# EAGLE design Tester (EAGLE 6.4)
COPYRIGHT: based on Transistortester (microcontroller.net); PROJECT_INFO: extented version with backlight dimmer; PROJECT_NAME: Component Tester
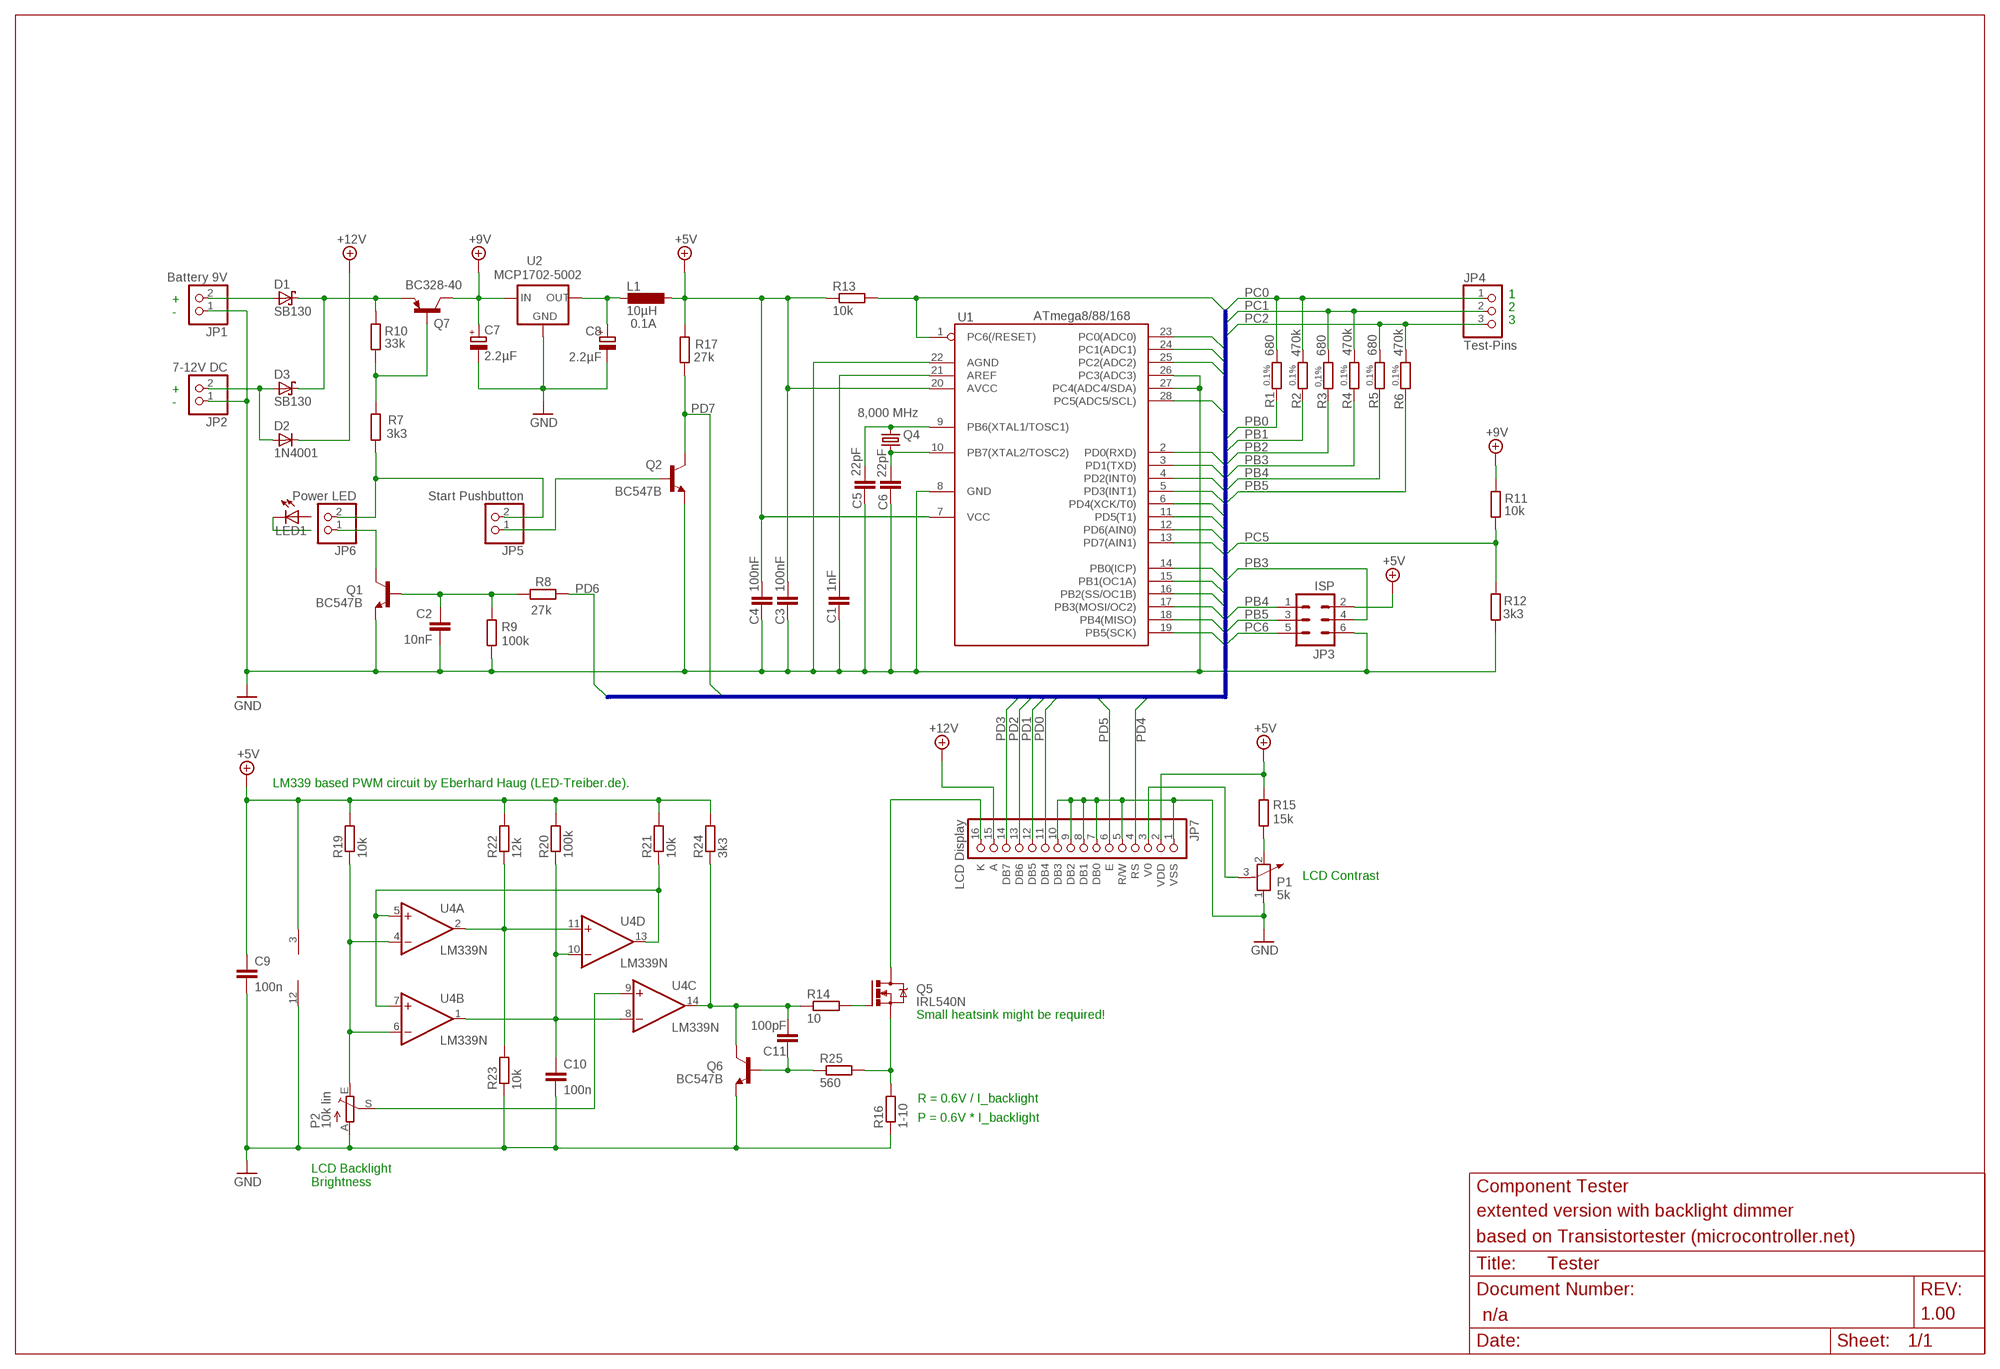
[diagram p0: schematic, sheet 1]
FRAME1 (FRAME_A3): DOCUMENT_ID: n/a; REVISION_ID: 1.00

## Parts
C1  1nF  C2.5/2  [C2.5-2]
C2  10nF  C2,5-3  [C2.5-3]
C3  100nF  C5/3  [C5B3]
C4  100nF  C5/3  [C5B3]
C5  22pF  C2,5-3  [C2.5-3]
C6  22pF  C2,5-3  [C2.5-3]
C7  2.2µF  CPOL-EUE5-5  [E5-5]
C8  2.2µF  CPOL-EUE5-5  [E5-5]
C9  100n  C-EU050-024X044  [C050-024X044]
C10  100n  C-EU050-024X044  [C050-024X044]
C11  100pF  C2.5/2  [C2.5-2]
D1  SB130  SCHOTTKY-DIODE_RAD3-5-A  [DIODE-3-5A-V]
D2  1N4001  DIODE_RAD3-5-A  [DIODE-3-5A-V]
D3  SB130  SCHOTTKY-DIODE_RAD3-5-A  [DIODE-3-5A-V]
JP1  Battery 9V  PINHD-1X2-PCB  [PINHD-1X02]
JP2  7-12V DC  PINHD-1X2-PCB  [PINHD-1X02]
JP3  ISP  ML6  [ML6]
JP4  Test-Pins  PINHD-1X3-PCB  [PINHD-1X03]
JP5  Start Pushbutton  PINHD-1X2-PCB  [PINHD-1X02]
JP6  Power LED  PINHD-1X2-PCB  [PINHD-1X02]
JP7  LCD Display  PINHD-1X16-LCD-TOP  [PINHD-1X16]
L1  10µH  L-EU0204/7  [0204/7]
LED1  LED_EXT  (no package)
P1  5k  POTENTIOMETER_PT-10  [PT-10]
P2  10k lin  TRIM_EU-LI10  [LI10]
Q1  BC547B  [TO92]
Q2  BC547B  [TO92]
Q4  8,000 MHz  CRYSTALHC49S  [HC49/S]
Q5  IRL540N  IRL540N-V  [TO220BV]
Q6  BC547B  [TO92]
Q7  BC328-40  [TO92-EBC]
R1  680  R-EU_0207/10  [0207/10]
R2  470k  R-EU_0207/10  [0207/10]
R3  680  R-EU_0207/10  [0207/10]
R4  470k  R-EU_0207/10  [0207/10]
R5  680  R-EU_0207/10  [0207/10]
R6  470k  R-EU_0207/10  [0207/10]
R7  3k3  R-EU_0207/10  [0207/10]
R8  27k  R-EU_0207/2V  [0207/2V]
R9  100k  R-EU_0207/2V  [0207/2V]
R10  33k  R-EU_0207/2V  [0207/2V]
R11  10k  R-EU_0207/2V  [0207/2V]
R12  3k3  R-EU_0207/2V  [0207/2V]
R13  10k  R-EU_0207/10  [0207/10]
R14  10  R-EU_0207/2V  [0207/2V]
R15  15k  R-EU_0207/10  [0207/10]
R16  1-10  R-EU_0207/10  [0207/10]
R17  27k  R-EU_0207/2V  [0207/2V]
R19  10k  R-EU_0207/2V  [0207/2V]
R20  100k  R-EU_0207/5V  [0207/5V]
R21  10k  R-EU_0207/2V  [0207/2V]
R22  12k  R-EU_0207/5V  [0207/5V]
R23  10k  R-EU_0207/5V  [0207/5V]
R24  3k3  R-EU_0207/5V  [0207/5V]
R25  560  R-EU_0207/5V  [0207/5V]
U1  ATmega8/88/168  MEGA8-P  [DIL28-3]
U2  MCP1702-5002  [TO92-LOWDROP]
U4  LM339N  [DIL14]

## Nets
+5V: C3.2 C4.1 C9.1 JP3.2 JP7.2(VDD) L1.1 R13.1 R15.1 R17.2 R19.2 R20.2 R21.2 R22.2 R24.2 U1.7(VCC) U1.20(AVCC) U4.3(P:V+)
+9V: C7.+ Q7.C R11.1 U2.IN
+12V: D2.C JP7.15(A)
BL_K: JP7.16(K) Q5.D
GND: C1.1 C2.2 C3.1 C4.2 C5.1 C6.1 C7.- C8.- C9.2 C10.2 JP1.1 JP2.1 JP3.6 JP7.1(VSS) JP7.5(R/W) JP7.7(DB0) JP7.8(DB1) JP7.9(DB2) JP7.10(DB3) P1.1 P2.A Q1.1(E) Q2.1(E) Q6.1(E) R9.1 R12.1 R16.1 R23.1 U1.8(GND) U1.22(AGND) U1.26(PC3(ADC3)) U1.27(PC4(ADC4/SDA)) U2.GND U4.12(P:GND)
N$1: P1.2 R15.2
N$2: JP7.3(V0) P1.3
N$3: Q5.S R16.2 R25.2
N$4: R22.1 R23.2 U4.2(A:OUT) U4.11(D:+IN)
N$5: D1.C D3.C Q7.E R10.1
N$6: C10.1 R20.1 U4.1(B:OUT) U4.8(C:-IN) U4.10(D:-IN)
N$7: R21.1 U4.5(A:+IN) U4.7(B:+IN) U4.13(D:OUT)
N$8: JP6.1 Q1.3(C)
N$9: D1.A JP1.2
N$10: C1.2 U1.21(AREF)
N$11: LED1.C
N$12: C5.2 Q4.2 U1.9(PB6(XTAL1/TOSC1))
N$13: C6.2 Q4.1 U1.10(PB7(XTAL2/TOSC2))
N$14: JP5.1 Q2.2(B)
N$15: P2.E R19.1 U4.4(A:-IN) U4.6(B:-IN)
N$16: P2.S U4.9(C:+IN)
N$17: C11.2 Q6.3(C) R14.1 R24.1 U4.14(C:OUT)
N$18: Q5.G R14.2
N$19: C11.1 Q6.2(B) R25.1
N$20: C8.+ L1.2 U2.OUT
N$21: JP5.2 JP6.2 R7.1
N$22: D2.A D3.A JP2.2
N$33: Q7.B R7.2 R10.2
N$35: C2.1 Q1.2(B) R8.2 R9.2
PB0: R1.1 U1.14(PB0(ICP))
PB1: R2.1 U1.15(PB1(OC1A))
PB2: R3.1 U1.16(PB2(SS/OC1B))
PB3: JP3.4 R4.1 U1.17(PB3(MOSI/OC2))
PB4: JP3.1 R5.1 U1.18(PB4(MISO))
PB5: JP3.3 R6.1 U1.19(PB5(SCK))
PC0: JP4.1 R1.2 R2.2 U1.23(PC0(ADC0))
PC1: JP4.2 R3.2 R4.2 U1.24(PC1(ADC1))
PC2: JP4.3 R5.2 R6.2 U1.25(PC2(ADC2))
PC5: R11.2 R12.2 U1.28(PC5(ADC5/SCL))
PC6: JP3.5 R13.2 U1.1(PC6(/RESET))
PD0: JP7.11(DB4) U1.2(PD0(RXD))
PD1: JP7.12(DB5) U1.3(PD1(TXD))
PD2: JP7.13(DB6) U1.4(PD2(INT0))
PD3: JP7.14(DB7) U1.5(PD3(INT1))
PD4: JP7.4(RS) U1.6(PD4(XCK/T0))
PD5: JP7.6(E) U1.11(PD5(T1))
PD6: R8.1 U1.12(PD6(AIN0))
PD7: Q2.3(C) R17.1 U1.13(PD7(AIN1))
Unconnected: LED1.A

## Buses
BUS1:PB[0..5],PC[0..6],PD[0..7]

## Notes on the sheet
- 1
- +
- 2
- -
- 3
- +
- -
- LM339 based PWM circuit by Eberhard Haug (LED-Treiber.de).
- LCD Contrast
- Small heatsink might be required!
- R = 0.6V / I_backlight
- P = 0.6V * I_backlight
- LCD Backlight
  Brightness

## Library data of the parts
C1-C6 C11 = capacitor-wima:C: CAPACITOR naming: grid - package width
C7 C8 = rcl:CPOL-EU: POLARIZED CAPACITOR, European symbol
C9 C10 = resistor:C-EU: CAPACITOR, European symbol
D1 D3 = markus:SCHOTTKY-DIODE: Schottky Diode
D2 = markus:DIODE: Diode
JP1 JP2 JP5 JP6 = markus:PINHD-1X2-PCB: PIN HEADER
JP3 = con-ml:ML6: HARTING; OC_FARNELL: unknown; OC_NEWARK: unknown
JP4 = markus:PINHD-1X3-PCB: PIN HEADER
JP7 = markus:PINHD-1X16-LCD: Pin Header for LCD module 16 pin supports bottom and top types
L1 = rcl:L-EU: INDUCTOR, European symbol; CURRENT: 0.1A
LED1 = markus:LED_EXT: Standard LED; _EXTERNAL_: external device
P1 = rcl:POTENTIOMETER_: Potentiometer
P2 = pot:TRIM_EU-: POTENTIOMETER
Q1 Q2 Q6 = transistor-npn:BC547*: NPN Transistor
Q4 = crystal:CRYSTAL: CRYSTAL; OC_FARNELL: 1667008; OC_NEWARK: unknown
Q5 = markus:IRL540N: HEXFET Power MOSFET Logic-Level Gate VDSS = 100V RDS(on) = 0.044Ω ID = 36A
Q7 = transistor-pnp:BC328*: PNP Transistror
R1 R2 R4-R6 = resistor:R-EU_: RESISTOR, European symbol; TOLERANCE: 0.1%
R3 = resistor:R-EU_: RESISTOR, European symbol; TOLERANCE: 0,1%
R7-R17 R19-R25 = resistor:R-EU_: RESISTOR, European symbol
U1 = avr-6:MEGA8-P: MICROCONTROLLER 8 Kbytes FLASH 1 kbytes SRAM 512 bytes EEPROM USART 4-channel 10 bit ADC 2-channel 8 bit ADC
U2 = asko:MCP1702-5002
U4 = linear:LM339: Low Power Low Offset Voltage Quad Comparators with open collector; LM139/LM239/LM339/LM2901/LM3302

## Net classes
0 default: width 0.406 mm, drill 0.8 mm

## Board
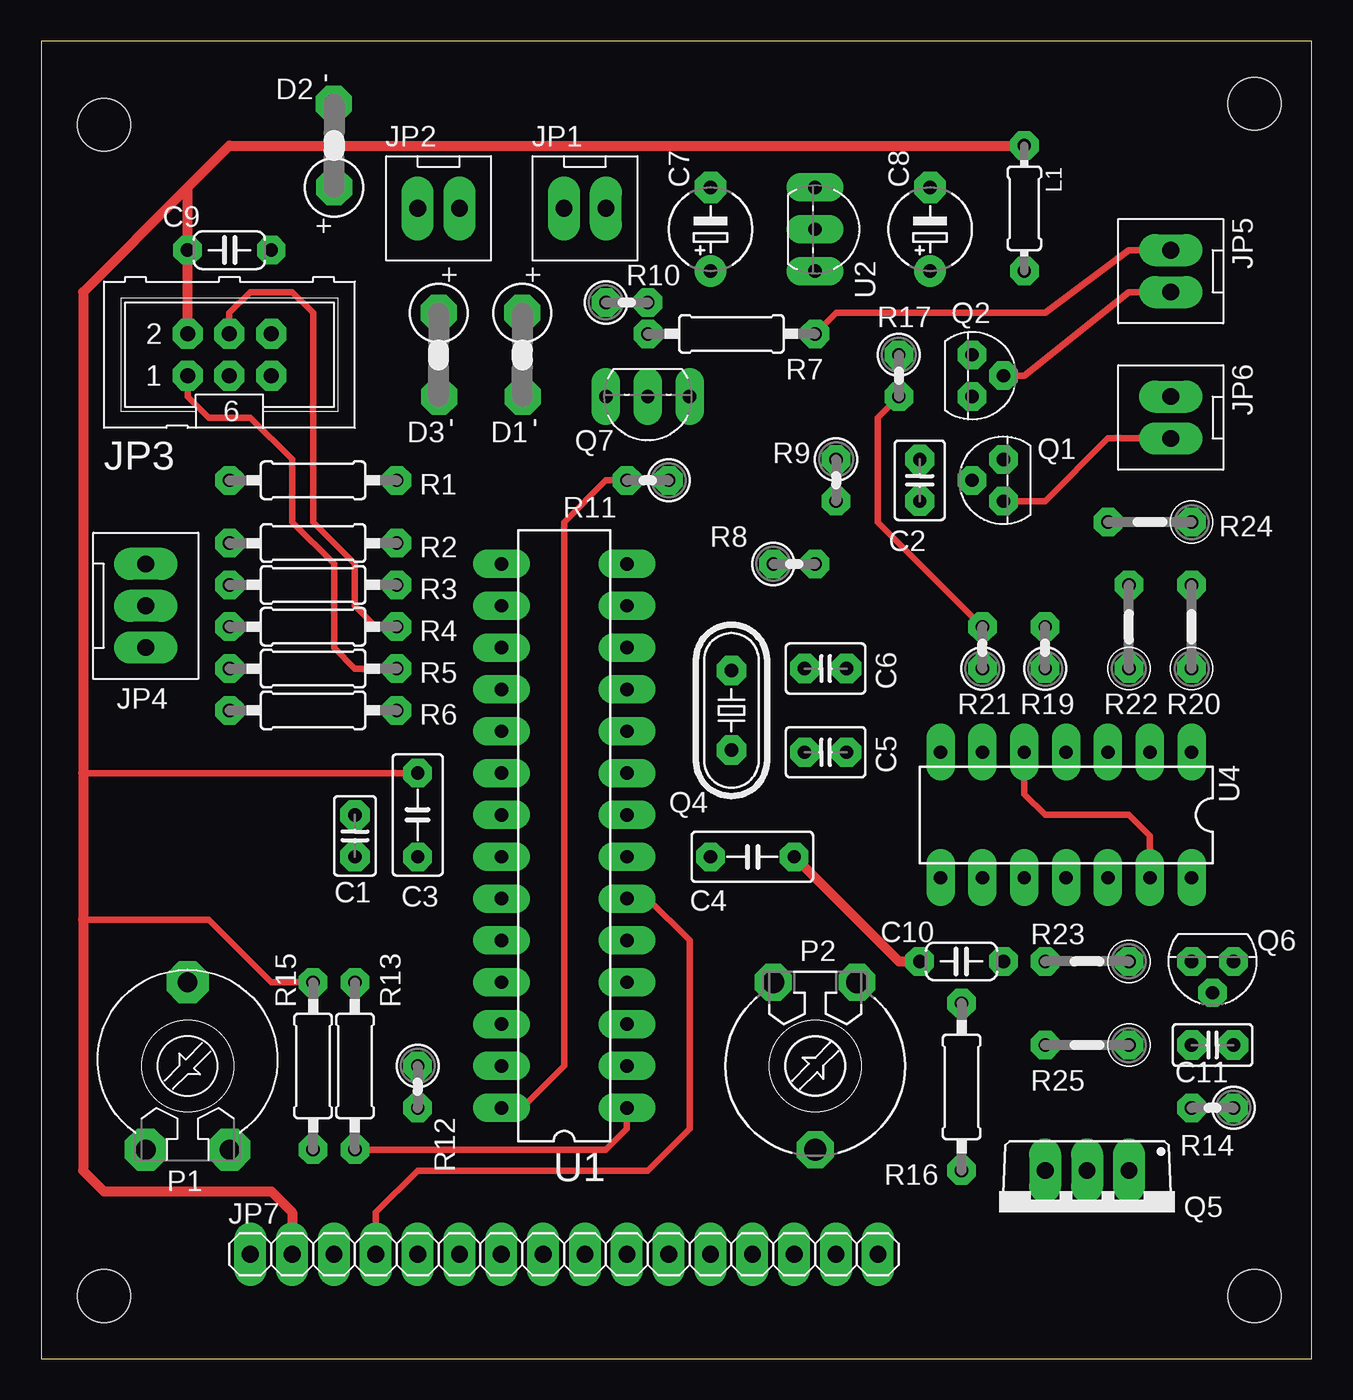
[diagram p1: board, top side]
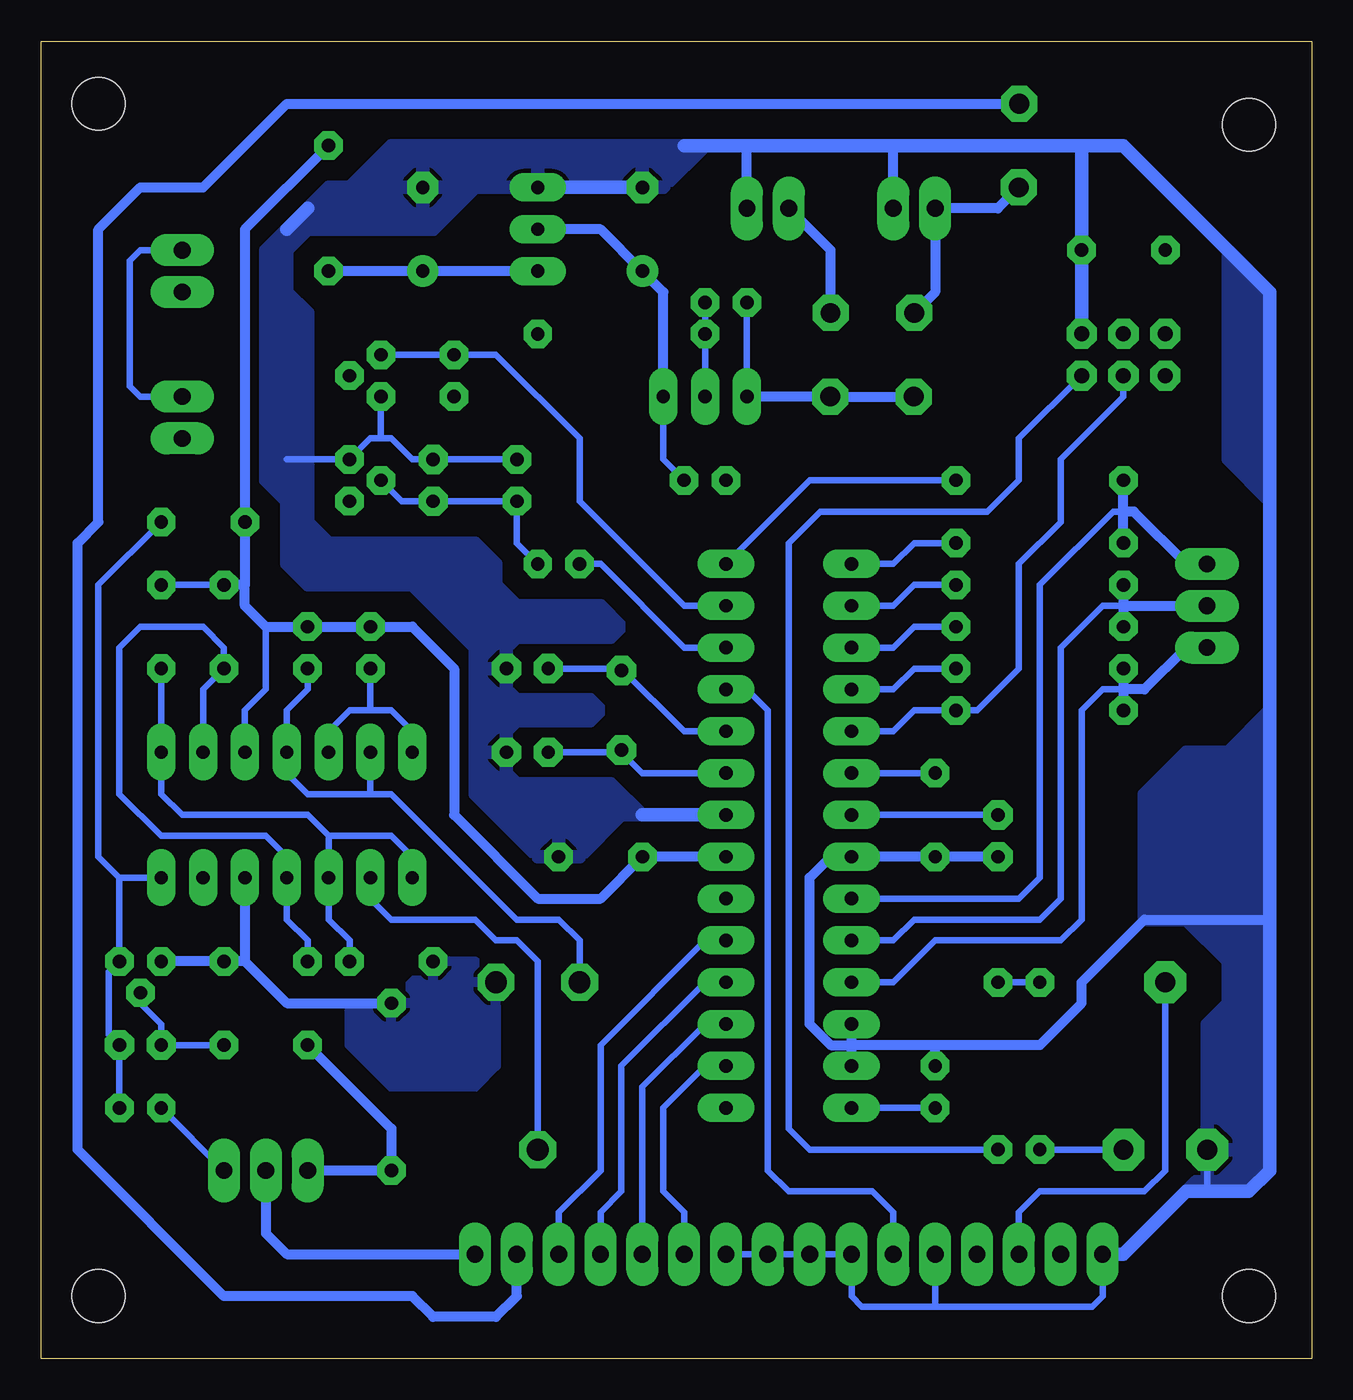
[diagram p2: board, bottom side, seen from below]

Size 77.14 x 80 mm. Coordinates in mm from the lower left corner, seen from the top.
Outline: 0,0 77.14,0 77.14,80 0,80 0,0
Copper layers (1*16): Top 0.035mm / dielectric 1.5mm / Bottom 0.035mm
Design rules "default": minimum track width 10mil, minimum drill 24mil, track to track 8mil, track to pad 8mil, pad to pad 8mil, via to via 8mil, smd to smd 8mil, copper to edge 40mil, drill to drill 8mil, minimum pad ring 18mil, minimum via ring 8mil, stop-mask expansion 4mil, vias tented up to drill 0mil, thermal gap 10mil
Holes 3.2 mm at 3.81,3.81 73.66,3.81 3.81,74.93 73.66,76.2

### Footprints (pad centres in the part's own frame; a part is rotated, then mirrored left to right if it is on the bottom)
C2.5-2 = drill 0.813 pad 1.778 octagon: 1 -1.27,0; 2 1.27,0
C2.5-3 = drill 0.813 pad 1.778 octagon: 1 -1.27,0; 2 1.27,0
C5B3 = drill 0.813 pad 1.6 octagon: 1 -2.54,0; 2 2.54,0
E5-5 = drill 0.813 pad 1.905: + -2.54,0 | drill 0.813 pad 1.905 octagon: - 2.54,0
C050-024X044 = drill 0.813 octagon: 1 -2.54,0; 2 2.54,0
DIODE-3-5A-V = drill 1.2 pad 2.184 octagon: A -2.54,0; C 2.54,0.025
PINHD-1X02 = drill 1.016 long: 1 1.27,0; 2 -1.27,0
ML6 = drill 0.914 octagon: 1 -2.54,-1.27; 2 -2.54,1.27; 3 0,-1.27; 4 0,1.27; 5 2.54,-1.27; 6 2.54,1.27
PINHD-1X03 = drill 1.016 long: 1 2.54,0; 2 0,0; 3 -2.54,0
PINHD-1X16 = drill 1.016 long: 1 -19.05,0; 2 -16.51,0; 3 -13.97,0; 4 -11.43,0; 5 -8.89,0; 6 -6.35,0; 7 -3.81,0; 8 -1.27,0; 9 1.27,0; 10 3.81,0; 11 6.35,0; 12 8.89,0; 13 11.43,0; 14 13.97,0; 15 16.51,0; 16 19.05,0
0204/7 = drill 0.813 octagon: 1 -3.81,0; 2 3.81,0
PT-10 = drill 1.2 pad 2.54 octagon: 1 -2.54,-5.08; 2 2.54,-5.08; 3 0,5.08
LI10 = drill 1.321 octagon: A -2.54,-5.08; E 2.54,-5.08; S 0,5.08
TO92 = drill 0.813 octagon: 1 1.27,0; 2 0,1.905; 3 -1.27,0
HC49/S = drill 0.813 pad 1.778 octagon: 1 -2.413,0; 2 2.413,0
TO220BV = drill 1.016 long: D 0,-2.54; G -2.54,-2.54; S 2.54,-2.54
TO92-EBC = drill 0.813 long: B 0,-1.27; C -2.54,-1.27; E 2.54,-1.27
0207/10 = drill 0.813 octagon: 1 -5.08,0; 2 5.08,0
0207/2V = drill 0.813 octagon: 1 -1.27,0; 2 1.27,0
0207/5V = drill 0.813 octagon: 1 -2.54,0; 2 2.54,0
DIL28-3 = drill 0.813 long: 1 -16.51,-3.81; 2 -13.97,-3.81; 3 -11.43,-3.81; 4 -8.89,-3.81; 5 -6.35,-3.81; 6 -3.81,-3.81; 7 -1.27,-3.81; 8 1.27,-3.81; 9 3.81,-3.81; 10 6.35,-3.81; 11 8.89,-3.81; 12 11.43,-3.81; 13 13.97,-3.81; 14 16.51,-3.81; 15 16.51,3.81; 16 13.97,3.81; 17 11.43,3.81; 18 8.89,3.81; 19 6.35,3.81; 20 3.81,3.81; 21 1.27,3.81; 22 -1.27,3.81; 23 -3.81,3.81; 24 -6.35,3.81; 25 -8.89,3.81; 26 -11.43,3.81; 27 -13.97,3.81; 28 -16.51,3.81
TO92-LOWDROP = drill 0.813 long: GND -3.81,0; IN -1.27,0; OUT 1.27,0
DIL14 = drill 0.813 long: 1 -7.62,-3.81; 2 -5.08,-3.81; 3 -2.54,-3.81; 4 0,-3.81; 5 2.54,-3.81; 6 5.08,-3.81; 7 7.62,-3.81; 8 7.62,3.81; 9 5.08,3.81; 10 2.54,3.81; 11 0,3.81; 12 -2.54,3.81; 13 -5.08,3.81; 14 -7.62,3.81

### Placement (x,y rotation side)
C1  19.05,31.75 90 top
C2  53.34,53.34 90 top
C3  22.86,33.02 90 top
C4  43.18,30.48 0 top
C5  47.62,36.83 180 top
C6  47.62,41.91 180 top
C7  40.64,68.58 90 top
C8  53.98,68.58 90 top
C9  11.43,67.31 0 top
C10  55.88,24.13 180 top
C11  71.12,19.05 0 top
D1  29.21,60.96 270 top
D2  17.78,73.66 90 top
D3  24.13,60.96 270 top
JP1  33.02,69.85 0 top
JP2  24.13,69.85 0 top
JP3  11.43,60.96 0 top
JP4  6.35,45.72 90 top
JP5  68.58,66.04 270 top
JP6  68.58,57.15 270 top
JP7  31.75,6.35 0 top
L1  59.69,69.85 270 top
P1  8.89,17.78 0 top
P2  46.99,17.78 180 top
Q1  58.42,53.34 90 top
Q2  56.52,59.69 270 top
Q4  41.91,39.37 270 top
Q5  63.5,8.89 180 top
Q6  71.12,24.13 180 top
Q7  36.83,57.15 180 top
R1  16.51,53.34 180 top
R2  16.51,49.53 180 top
R3  16.51,46.99 180 top
R4  16.51,44.45 180 top
R5  16.51,41.91 180 top
R6  16.51,39.37 180 top
R7  41.91,62.23 180 top
R8  45.72,48.26 0 top
R9  48.26,53.34 270 top
R10  35.56,64.14 0 top
R11  36.83,53.34 180 top
R12  22.86,16.51 270 top
R13  19.05,17.78 270 top
R14  71.12,15.24 180 top
R15  16.51,17.78 270 top
R16  55.88,16.51 270 top
R17  52.07,59.69 270 top
R19  60.96,43.18 90 top
R20  69.85,44.45 90 top
R21  57.15,43.18 90 top
R22  66.04,44.45 90 top
R23  63.5,24.13 180 top
R24  67.31,50.8 180 top
R25  63.5,19.05 180 top
U1  31.75,31.75 90 top
U2  46.99,67.31 270 top
U4  62.23,33.02 180 top

### Tracks (layer width: path | path; a pad name or v marks a point on that pad's centre or on a via)
+5V
  Top 0.406: C3.2 2.54,35.56 | R15.1 13.97,22.86 10.16,26.67 2.54,26.67 | R17.2 50.8,57.15 50.8,50.8 R21.2
  Top 0.61: JP7.2 15.24,8.89 13.97,10.16 3.81,10.16 2.54,11.43 2.54,26.67 2.54,35.56 2.54,64.77 8.89,71.12 | 8.89,71.12 11.43,73.66 L1.1 | 8.89,71.12 C9.1 JP3.2
  Bottom 0.406: U1.20 C3.2 | R15.1 R13.1 | R20.2 R22.2 | U4.3 64.77,39.37 63.5,40.64 63.5,44.45
  Bottom 0.61: U1.7 C4.1 43.18,27.94 46.99,27.94 52.07,33.02 52.07,41.91 54.61,44.45 R21.2 R19.2 63.5,44.45 64.77,45.72 64.77,46.99 | L1.1 64.77,68.58 R24.2 64.77,46.99 | 64.77,46.99 R22.2
+9V
  Bottom 0.406: Q7.C 39.37,54.61 R11.1
  Bottom 0.61: U2.IN 43.18,68.58 C7.+ 39.37,64.77 Q7.C
+12V
  Bottom 0.61: JP7.15 48.26,3.81 49.53,2.54 53.34,2.54 54.61,3.81 66.04,3.81 74.93,12.7 74.93,49.53 73.66,50.8 73.66,68.58 71.12,71.12 67.31,71.12 62.23,76.2 D2.C
BL_K
  Bottom 0.61: Q5.D 63.5,7.62 62.23,6.35 JP7.16
GND
  Top 0.61: C4.2 52.07,24.13 C10.2
  Bottom 0.406: JP7.10 JP7.9 JP7.8 JP7.7 27.94,3.81 27.3,3.17 22.86,3.17 | 22.86,3.17 13.34,3.17 12.7,3.81 JP7.1 | JP7.5 22.86,3.17 | P1.1 6.35,10.16 | 62.23,54.61 Q1.1 57.15,55.88 56.52,55.88 | 56.52,55.88 55.88,55.88 54.61,54.61 C2.2 R9.1 | Q2.1 56.52,55.88
  Bottom 0.61: C1.1 C3.1 U1.22 29.21,30.48 30.48,29.21 30.48,20.32 29.21,19.05 27.94,19.05 | U1.27 27.94,19.05 | 27.94,19.05 U1.26 | 2.54,26.67 10.16,26.67 13.97,22.86 13.97,21.59 16.51,19.05 22.86,19.05 | 22.86,19.05 27.94,19.05 | R12.1 22.86,19.05 | U4.12 64.77,24.13 | 64.77,24.13 62.23,21.59 R16.1 | 64.77,24.13 R23.1 Q6.1 | JP1.1 34.29,73.66 | JP2.1 25.4,73.66
  Bottom 0.813: C7.- U2.GND | 13.97,73.66 11.43,73.66 2.54,64.77 2.54,26.67 2.54,11.43 3.81,10.16 6.35,10.16 7.62,10.16 11.43,6.35 JP7.1 | 13.97,73.66 25.4,73.66 34.29,73.66 38.1,73.66 | 60.96,69.85 62.23,68.58 | U1.8 40.64,33.02 | JP3.6 C9.2 13.97,73.66
  pour Bottom: 2.54,39.37 5.08,36.83 7.62,36.83 10.16,34.29 10.16,26.67 7.62,26.67 5.08,24.13 5.08,21.59 6.35,20.32 6.35,11.43 7.62,10.16 3.81,10.16 2.54,11.43
  pour Bottom: 2.54,52.07 5.08,54.61 5.08,67.31 2.54,64.77
  pour Bottom: 36.83,73.66 39.37,71.12 50.8,71.12 53.34,68.58 60.96,68.58 62.23,67.31 62.23,64.77 60.96,63.5 60.96,50.8 59.69,49.53 50.8,49.53 49.53,48.26 49.53,46.99 48.26,45.72 43.18,45.72 41.91,44.45 42.55,43.81 48.26,43.81 48.9,43.18 48.9,40.64 48.26,40.01 43.81,40.01 43.18,39.37 43.81,38.73 48.26,38.73 48.9,38.1 48.9,35.56 48.26,34.92 42.55,34.92 40.64,33.02 41.91,33.02 44.45,30.48 46.99,30.48 50.8,34.29 50.8,43.18 54.61,46.99 60.96,46.99 62.23,48.26 62.23,52.07 63.5,53.34 63.5,67.31 59.69,71.12 58.42,71.12 55.88,73.66
  pour Bottom: 49.53,22.86 49.53,17.78 50.8,16.51 55.88,16.51 58.42,19.05 58.42,21.59 55.88,21.59 53.34,24.13 50.8,24.13
N$1
  Bottom 0.406: P1.2 R15.2
N$2
  Bottom 0.406: JP7.3 17.78,8.89 16.51,10.16 10.16,10.16 8.89,11.43 P1.3
N$3
  Bottom 0.61: Q5.S R16.2 55.88,13.97 R25.2
N$4
  Bottom 0.406: U4.2 67.31,40.64 R22.1 66.04,43.18 67.31,44.45 71.12,44.45 72.39,43.18 72.39,34.29 69.85,31.75 63.5,31.75 62.23,30.48 U4.11 62.23,26.67 60.96,25.4 R23.2
N$5
  Bottom 0.406: R10.1 Q7.E | D1.C 29.21,58.42
  Bottom 0.61: Q7.E 29.21,58.42 D3.C
N$6
  Bottom 0.406: U4.8 54.61,30.48 55.88,31.75 59.69,31.75 | 59.69,31.75 U4.10 59.69,26.67 58.42,25.4 C10.1 | 59.69,31.75 60.96,33.02 68.58,33.02 69.85,34.29 U4.1 R20.1
N$7
  Top 0.406: U4.5 59.69,34.29 60.96,33.02 66.04,33.02 67.31,31.75 U4.13
  Bottom 0.406: U4.5 59.69,38.1 58.42,39.37 57.15,39.37 | 57.15,39.37 55.88,39.37 54.61,38.1 U4.7 | 57.15,39.37 R21.1
N$8
  Top 0.406: Q1.3 60.96,52.07 64.77,55.88 JP6.1
N$9
  Bottom 0.61: D1.A 29.21,67.31 JP1.2
N$10
  Bottom 0.406: U1.21 C1.2
N$12
  Bottom 0.406: U1.9 40.64,35.56 41.91,36.83 | 41.91,36.83 C5.2 | 41.91,36.83 Q4.2
N$13
  Bottom 0.406: U1.10 38.1,38.1 41.91,41.91 | 41.91,41.91 C6.2 | 41.91,41.91 Q4.1
N$14
  Top 0.406: Q2.2 59.69,59.69 66.04,64.77 JP5.1
N$15
  Bottom 0.406: 57.15,34.29 60.96,34.29 62.23,35.56 U4.4 62.23,39.37 60.96,40.64 R19.1 | P2.E 44.45,25.4 45.72,26.67 48.26,26.67 55.88,34.29 57.15,34.29 | 57.15,34.29 U4.6
N$16
  Bottom 0.406: P2.S 46.99,24.13 48.26,25.4 49.53,25.4 50.8,26.67 55.88,26.67 57.15,27.94 U4.9
N$17
  Bottom 0.406: R24.1 73.66,46.99 73.66,30.48 72.39,29.21 | 72.39,29.21 U4.14 | 72.39,29.21 Q6.3 73.03,23.5 73.03,19.68 C11.2 R14.1
N$18
  Bottom 0.406: Q5.G R14.2
N$19
  Bottom 0.406: Q6.2 71.12,21.59 69.85,20.32 C11.1 R25.1
N$20
  Bottom 0.61: U2.OUT C8.+ L1.2
N$21
  Top 0.406: R7.1 48.26,63.5 60.96,63.5 66.04,67.31 JP5.2
  Bottom 0.406: JP5.2 71.12,67.31 71.75,66.67 71.75,59.05 71.12,58.42 JP6.2
N$22
  Bottom 0.61: D3.A 22.86,64.77 JP2.2 19.05,69.85 D2.A
N$33
  Bottom 0.406: Q7.B R7.2 R10.2
N$35
  Bottom 0.406: R8.2 48.26,49.53 R9.2 C2.1 55.24,52.07 Q1.2
PB0
  Bottom 0.406: R1.1 30.48,53.34 U1.14
PB1
  Bottom 0.406: R2.1 24.13,49.53 25.4,48.26 U1.15
PB2
  Bottom 0.406: R3.1 24.13,46.99 25.4,45.72 U1.16
PB3
  Top 0.406: JP3.4 11.43,63.5 12.7,64.77 15.24,64.77 16.51,63.5 16.51,50.8 19.05,48.26 19.05,45.72 20.32,44.45 R4.1
  Bottom 0.406: R4.1 24.13,44.45 25.4,43.18 U1.17
PB4
  Top 0.406: JP3.1 8.89,58.42 10.16,57.15 12.7,57.15 15.24,54.61 15.24,50.8 17.78,48.26 17.78,43.18 19.05,41.91 R5.1
  Bottom 0.406: R5.1 24.13,41.91 25.4,40.64 U1.18
PB5
  Bottom 0.406: U1.19 25.4,38.1 24.13,39.37 R6.1 20.32,39.37 17.78,41.91 17.78,48.26 15.24,50.8 15.24,54.61 11.43,58.42 JP3.3
PC0
  Bottom 0.406: U1.23 17.78,27.94 16.51,29.21 16.51,46.99 12.06,51.44 11.43,51.44
  Bottom 0.61: R2.2 11.43,51.44 | 11.43,51.44 R1.2 | JP4.1 7.62,48.26 10.79,51.44 11.43,51.44
PC1
  Bottom 0.406: U1.24 25.4,25.4 24.13,26.67 16.51,26.67 15.24,27.94 15.24,43.18 12.7,45.72 11.43,45.72
  Bottom 0.61: R3.2 11.43,45.72 | 11.43,45.72 R4.2 | 11.43,45.72 JP4.2
PC2
  Bottom 0.406: U1.25 25.4,22.86 22.86,25.4 15.24,25.4 13.97,26.67 13.97,39.37 12.7,40.64 11.43,40.64
  Bottom 0.61: R5.2 11.43,40.64 | 11.43,40.64 R6.2 | JP4.3 7.62,43.18 10.16,40.64 11.43,40.64
PC5
  Top 0.406: R11.2 34.29,53.34 31.75,50.8 31.75,17.78 29.21,15.24 U1.28
  Bottom 0.406: U1.28 R12.2
PC6
  Top 0.406: R13.2 34.29,12.7 35.56,13.97 U1.1
  Bottom 0.406: JP3.5 17.78,55.88 17.78,53.34 19.68,51.44 29.84,51.44 31.75,49.53 31.75,13.97 30.48,12.7 R13.2
PD0
  Bottom 0.406: U1.2 36.83,17.78 39.37,15.24 39.37,10.16 38.1,8.89 JP7.11
PD1
  Bottom 0.406: U1.3 36.83,20.32 40.64,16.51 JP7.12
PD2
  Bottom 0.406: U1.4 36.83,22.86 41.91,17.78 41.91,10.16 43.18,8.89 JP7.13
PD3
  Bottom 0.406: U1.5 36.83,25.4 43.18,19.05 43.18,11.43 45.72,8.89 JP7.14
PD4
  Top 0.406: U1.6 36.83,27.94 39.37,25.4 39.37,13.97 36.83,11.43 22.86,11.43 20.32,8.89 JP7.4
PD5
  Bottom 0.406: U1.11 34.29,40.64 33.02,39.37 33.02,11.43 31.75,10.16 26.67,10.16 25.4,8.89 JP7.6
PD6
  Bottom 0.406: U1.12 38.1,43.18 43.18,48.26 R8.1
PD7
  Bottom 0.406: U1.13 38.1,45.72 44.45,52.07 44.45,55.88 49.53,60.96 R17.1 Q2.3